# Altium project AP-PAM-V3_1.PrjPcb
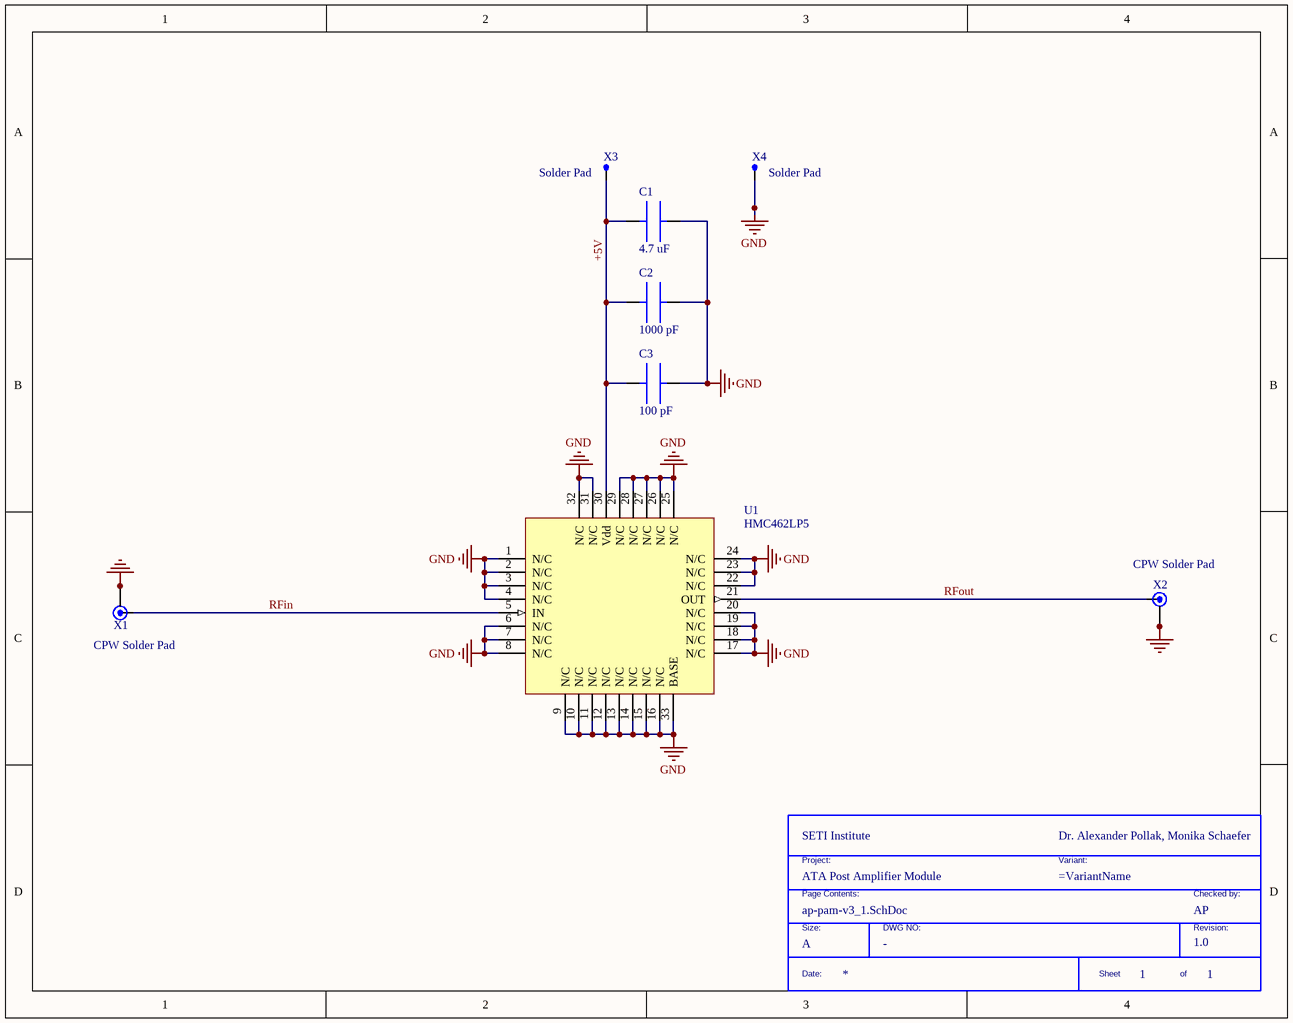
[diagram p0: ap-pam-v3_1.SchDoc]
Company: SETI Institute; DesignedBy: Dr. Alexander Pollak, Monika Schaefer; Project: ATA Post Amplifier Module; Revision: 2.0
1 sheet, 9 parts. Net scope: global (net labels, ports and power ports of the same name join across sheets).
Board file: ap-pam-v3_1.PcbDoc

## Sheet ap-pam-v3_1.SchDoc: ATA Post Amplifier Module
size A; Author: Dr. Alexander Pollak; DrawnBy: Dr. Alexander Pollak; DocumentNumber: 1; Revision: 1.0; SheetNumber: 1; SheetTotal: 1

### Parts
*  Size: A  Checked by: AP  (graphical)
C1  4.7 uF  [C4_7uF]
C2  1000 pF  [C1000pF]
C3  100 pF  [C100pF]
U1  HMC462LP5  [HMC462LP5E]
X1  CPW Solder Pad  [CPW Edge Connector]
X2  CPW Solder Pad  [CPW Edge Connector]
X3  Solder Pad  [Solder Pad]
X4  Solder Pad  [Solder Pad]

### Nets
GND: C1.2 C2.1 C3.1 U1.1(N/C) U1.2(N/C) U1.3(N/C) U1.4(N/C) U1.6(N/C) U1.7(N/C) U1.8(N/C) U1.9(N/C) U1.10(N/C) U1.11(N/C) U1.12(N/C) U1.13(N/C) U1.14(N/C) U1.15(N/C) U1.16(N/C) U1.17(N/C) U1.18(N/C) U1.19(N/C) U1.20(N/C) U1.22(N/C) U1.23(N/C) U1.24(N/C) U1.25(N/C) U1.26(N/C) U1.27(N/C) U1.28(N/C) U1.29(N/C) U1.31(N/C) U1.32(N/C) U1.33(BASE) X1.2 X1.3 X2.2 X2.3 X4.1
+5V: C1.1 C2.2 C3.2 U1.30(Vdd) X3.1
RFin: U1.5(IN) X1.1
RFout: U1.21(OUT) X2.1

### Notes on the sheet
- (in symbol TitleBlock) Project:; Variant:; Page Contents:; Checked by:; Size:; DWG NO:; Revision:; Date:; Sheet; of

### Library data of the parts
* = TitleBlock: Standard Title Block; DWG NO: -
C1 = TH3A475K010C2900: Tantalum Capacitor, Polarized, Tantalum (dry/solid), 10V, 10% +Tol, 10% -Tol, 4.7uF, Surface Mount, 1306; Manufacturer: Vishay Sprague; ESR (Equivalent Series Resistance): 2.9R; Leakage Current: 500nA; Ripple Current: 160mA; Tan Delta: 0.06; Reference Standard: AEC-Q200; Supplier: Future Electronics; Supplier Part Number: 4924098; Manufacturer Part Number: TH3A475K010C2900; RoHS: Yes; Category: Tantalum Capacitors; Stock: 2000; Pricing: 2000=0.178, 4000=0.175, 6000=0.173, 8000=0.171, 10000=0.166 (USD); Mounting Technology: Surface Mount; Pins: 2; Dielectric Material: Tantalum; Package Shape: Rectangular; Case/Package: 1206; Terminal Finish: Tin; Min Operating Temperature: -55°C; Max Operating Temperature: 150°C; JESD-609 Code: e3; Polarity: Polarized; Value: 4.7uF; Capacitor Type: Tantalum; Tolerance  (fill in as +-): 10%; Package Style: SMTMeter; Packaging: Tape and Reel; Tolerance (fill in as +-): 10%; Rated DC Voltage (URdc): 10V; Termination: J BEND; Length: 3.2mm; Width: 1.6mm; Height: 1.6mm; Reach SVHC Compliant: Yes; RoHS Compliant: Yes; ComponentLink1URL: https://datasheet.ciiva.com:443/pdfs/VipMasterIC/IC/VISH/VISH-S-A0010085390/VISH-S-A0010085390-1.pdf?src-supplier=IHS+Markit; ComponentLink1Description: https://datasheet.ciiva.com:443/pdfs/VipMasterIC/IC/VISH/VISH-S-A0010085390/VISH-S-A0010085390-1.pdf?src-supplier=IHS+Markit; ComponentLink2URL: https://datasheet.ciiva.com/268/th3-268785.pdf?src-supplier=Digikey; ComponentLink2Description: https://datasheet.ciiva.com/268/th3-268785.pdf?src-supplier=Digikey; ComponentLink3URL: https://datasheet.ciiva.com/16360/th3-16360891.pdf?src-supplier=Future+Electronics; ComponentLink3Description: https://datasheet.ciiva.com/16360/th3-16360891.pdf?src-supplier=Future+Electronics
C2 = GCM1885C1H102FA16D: Ceramic Capacitor, Multilayer, Ceramic, 50V, 1% +Tol, 1% -Tol, C0G, 30ppm/Cel TC, 0.001uF, Surface Mount, 0603; Manufacturer: Murata; Value: 1nF; Multilayer: Yes; Reference Standard: AEC-Q200; Supplier: Mouser; Supplier Part Number: 81-GCM1885C1H102FA6D; Manufacturer Part Number: GCM1885C1H102FA16D; RoHS: Yes; Category: Ceramic Capacitors; Stock: 27229; Pricing: 1=0.35, 10=0.229, 50=0.229, 100=0.138, 1000=0.092, 10000=0.074 (USD); Mounting Technology: Surface Mount; Pins: 2; Dielectric Material: Ceramic; Package Shape: Rectangular; Case/Package: 0603; Min Operating Temperature: -55°C; Max Operating Temperature: 125°C; Capacitor Type: Ceramic; Tolerance  (fill in as +-): 1%; Packaging: Tape and Reel; Tolerance (fill in as +-): 1%; Rated DC Voltage (URdc): 50V; Temperature Characteristics Code: C0G; Termination: Wraparound; Reach SVHC Compliant: Yes; RoHS Compliant: Yes; ComponentLink1URL: https://datasheet.ciiva.com:443/pdfs/VipMasterIC/IC/MURE/MURE-S-A0004370842/MURE-S-A0004372260-1.pdf?src-supplier=IHS+Markit; ComponentLink1Description: https://datasheet.ciiva.com:443/pdfs/VipMasterIC/IC/MURE/MURE-S-A0004370842/MURE-S-A0004372260-1.pdf?src-supplier=IHS+Markit
C3 = GRM1555C2A101FA01D: Multilayer Ceramic Capacitors MLCC - SMD/SMT 100 pF 100 VDC 1% 0402 C0G (NP0); Manufacturer: Murata; Supplier: Mouser; Supplier Part Number: 81-GRM1555C2A11FA1D; Manufacturer Part Number: GRM1555C2A101FA01D; RoHS: No; Stock: 21646; Pricing: 1=0.18, 10=0.119, 50=0.119, 100=0.06, 1000=0.039, 10000=0.035 (USD)
U1 = HMC462LP5: Wide Band Low Power Amplifier, 2000MHz Min, 20000MHz Max, 1 Func, GAAS; Manufacturer: Analog Devices; Package Body Material: Plastic; Channels: 1; Package Equivalence Code: LCC32,.2SQ,20; Power Supplies: 5V; Characteristic Impedance: 50R; Gain: 10dB; Operating Frequency-Max: 20GHz; Operating Frequency-Min: 2GHz; Supplier: Mouser; Supplier Part Number: 584-HMC462LP5; Manufacturer Part Number: HMC462LP5; RoHS: No; Category: RF Amplifiers; Stock: 3; Pricing: 1=255.72, 10=223.37, 50=223.37, 100=223.37, 1000=223.37, 10000=223.37 (USD); Mounting Technology: Surface Mount; Pins: 32; Terminal Finish: Tin; Min Operating Temperature: -40°C; Max Operating Temperature: 85°C; RF/Microwave Device Type: WIDE BAND LOW POWER; Technology: GAAS; JESD-609 Code: e0; Construction: COMPONENT; Reach SVHC Compliant: Yes; RoHS Compliant: No; ComponentLink1URL: https://datasheet.ciiva.com:443/pdfs/VipMasterIC/IC/HTMW/HTMWS06009/HTMWS06009-1.pdf?src-supplier=IHS+Markit; ComponentLink1Description: https://datasheet.ciiva.com:443/pdfs/VipMasterIC/IC/HTMW/HTMWS06009/HTMWS06009-1.pdf?src-supplier=IHS+Markit; ComponentLink2URL: http://www.mouser.com/ds/2/609/hmc462lp5-468009.pdf?src-supplier=Mouser; ComponentLink2Description: http://www.mouser.com/ds/2/609/hmc462lp5-468009.pdf?src-supplier=Mouser; ComponentLink3URL: http://www.hittite.com/content/documents/data_sheet/hmc462lp5.pdf?src-supplier=Avnet; ComponentLink3Description: http://www.hittite.com/content/documents/data_sheet/hmc462lp5.pdf?src-supplier=Avnet; ComponentLink4URL: https://www.analog.com/media/en/technical-documentation/data-sheets/hmc462.pdf?src-supplier=Digikey; ComponentLink4Description: https://www.analog.com/media/en/technical-documentation/data-sheets/hmc462.pdf?src-supplier=Digikey; ComponentLink5URL: https://datasheet.octopart.com/HMC462LP5-Analog-Devices-datasheet-34213376.pdf?src-supplier=Newark; ComponentLink5Description: https://datasheet.octopart.com/HMC462LP5-Analog-Devices-datasheet-34213376.pdf?src-supplier=Newark
X1 X2 = RF  CPW Solder Pad: Solder pad for RF Coplanar Waveguide Rogers 4350B Thickness 0.020" Copper 1oz
X3 X4 = Solder Pad: Pad to solder wires to